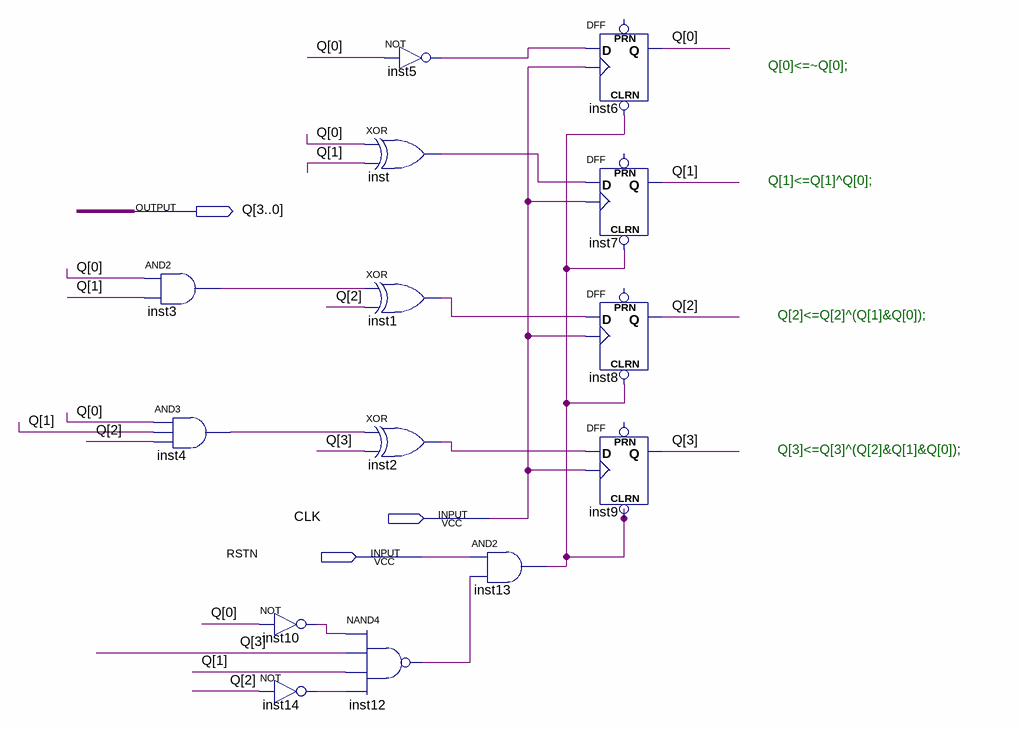
[diagram p0: schematic sheet]
// Quartus schematic lab502BCDcnt2.bdf as structural Verilog: 14 symbols, 3 pins
module lab502BCDcnt2 (
  input  CLK,
  input  RSTN,
  output [3:0] Q
);

  wire inst1_out, inst2_out, inst3_out, inst4_out, inst5_out, inst10_out, inst12_out, inst13_out, inst14_out,
       inst_out;

  and inst3 (inst3_out, Q[0], Q[1]);
  and inst4 (inst4_out, Q[0], Q[1], Q[2]);
  not inst10 (inst10_out, Q[0]);
  not inst14 (inst14_out, Q[2]);
  nand inst12 (inst12_out, inst10_out, Q[3], Q[1], inst14_out);
  not inst5 (inst5_out, Q[0]);
  xor inst (inst_out, Q[0], Q[1]);
  xor inst1 (inst1_out, inst3_out, Q[2]);
  xor inst2 (inst2_out, inst4_out, Q[3]);
  and inst13 (inst13_out, RSTN, inst12_out);
  DFF inst6 (.CLRN(inst13_out), .CLK(CLK), .D(inst5_out), .Q(Q[0]));  // open: PRN
  DFF inst7 (.CLRN(inst13_out), .CLK(CLK), .D(inst_out), .Q(Q[1]));  // open: PRN
  DFF inst8 (.CLRN(inst13_out), .CLK(CLK), .D(inst1_out), .Q(Q[2]));  // open: PRN
  DFF inst9 (.CLRN(inst13_out), .CLK(CLK), .D(inst2_out), .Q(Q[3]));  // open: PRN

  // Notes on the sheet:
  //   Q[0]<=~Q[0];
  //   Q[1]<=Q[1]^Q[0];
  //   Q[2]<=Q[2]^(Q[1]&Q[0]);
  //   Q[3]<=Q[3]^(Q[2]&Q[1]&Q[0]);
endmodule
